# EAGLE design untitled (EAGLE 9.6.0)

## Sheet 1 of 2
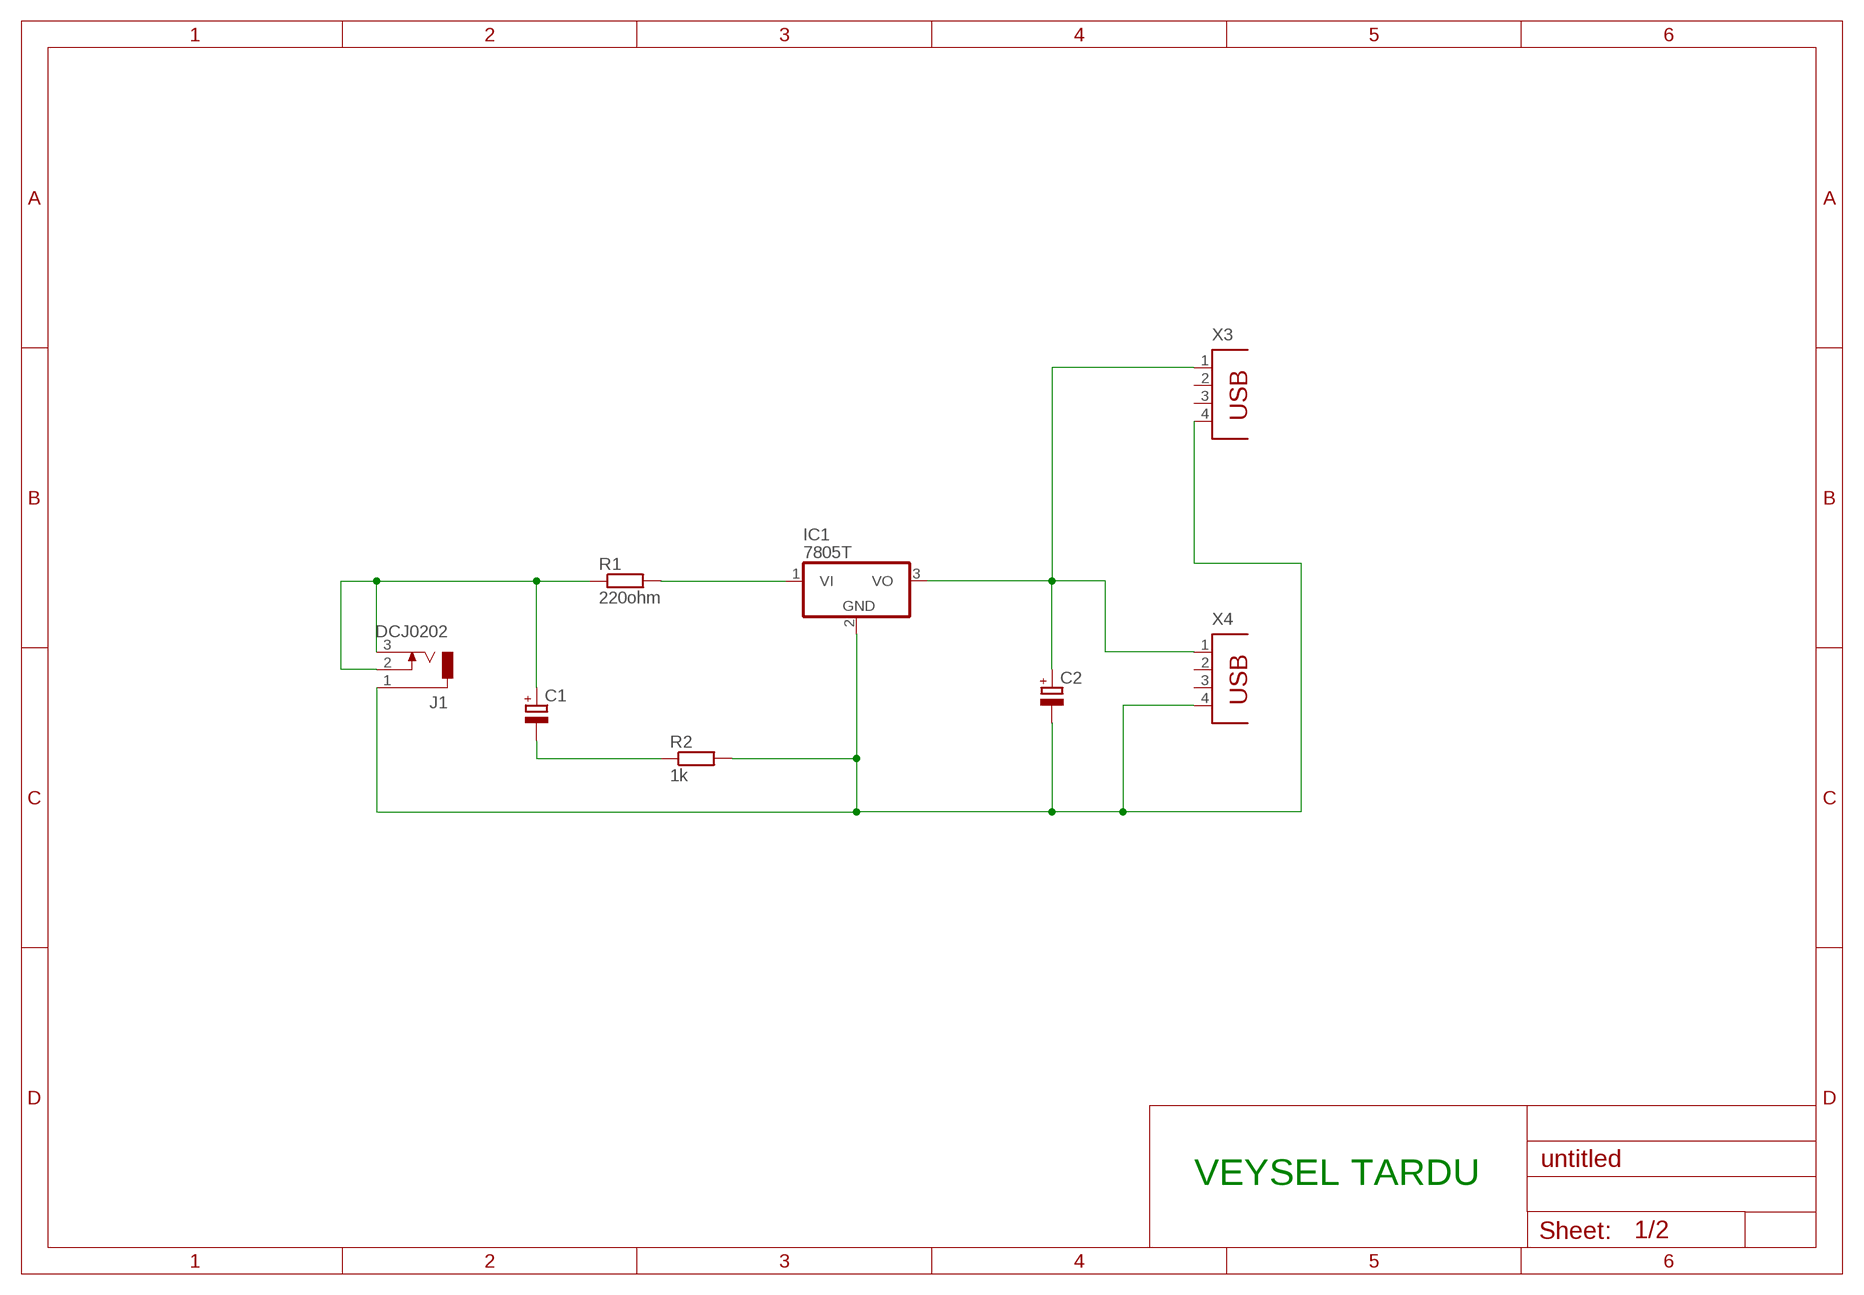
[diagram p0: schematic, sheet 1]

### Parts
C1  CPOL-EUE2-5  [E2-5]
C2  CPOL-EUE2-5  [E2-5]
IC1  7805T  [TO220H]
J1  DCJ0202  [DCJ0202]
R1  220ohm  R-EU_VMTA55  [VMTA55]
R2  1k  R-EU_VMTA55  [VMTA55]
X3  PN61729  [PN61729]
X4  PN61729  [PN61729]

### Nets
N$1: C1.+ J1.2 J1.3 R1.1
N$2: IC1.1(VI) R1.2
N$4: C2.- IC1.2(GND) J1.1 R2.2 X3.4 X4.4
N$5: C2.+ IC1.3(VO) X3.1 X4.1
N$6: C1.- R2.1
Unconnected: X3.2 X3.3 X4.2 X4.3

### Notes on the sheet
- VEYSEL TARDU

## Sheet 2 of 2

## Library data of the parts
C1 C2 = rcl:CPOL-EU: POLARIZED CAPACITOR, European symbol; SPICEPREFIX: C
IC1 = linear:78*: Positive VOLTAGE REGULATOR Source: http://cache.national.com/ds/LM/LM78L05.pdf http://www.fairchildsemi.com/ds/LM/LM7805.pdf
J1 = con-jack:DCJ0202: DC POWER JACK Source: DCJ0202.pdf; OC_FARNELL: unknown; OC_NEWARK: unknown
R1 R2 = rcl:R-EU_: RESISTOR, European symbol; SPICEPREFIX: R
X3 X4 = con-berg:PN61729: BERG USB connector; OC_FARNELL: unknown; OC_NEWARK: unknown

## Board
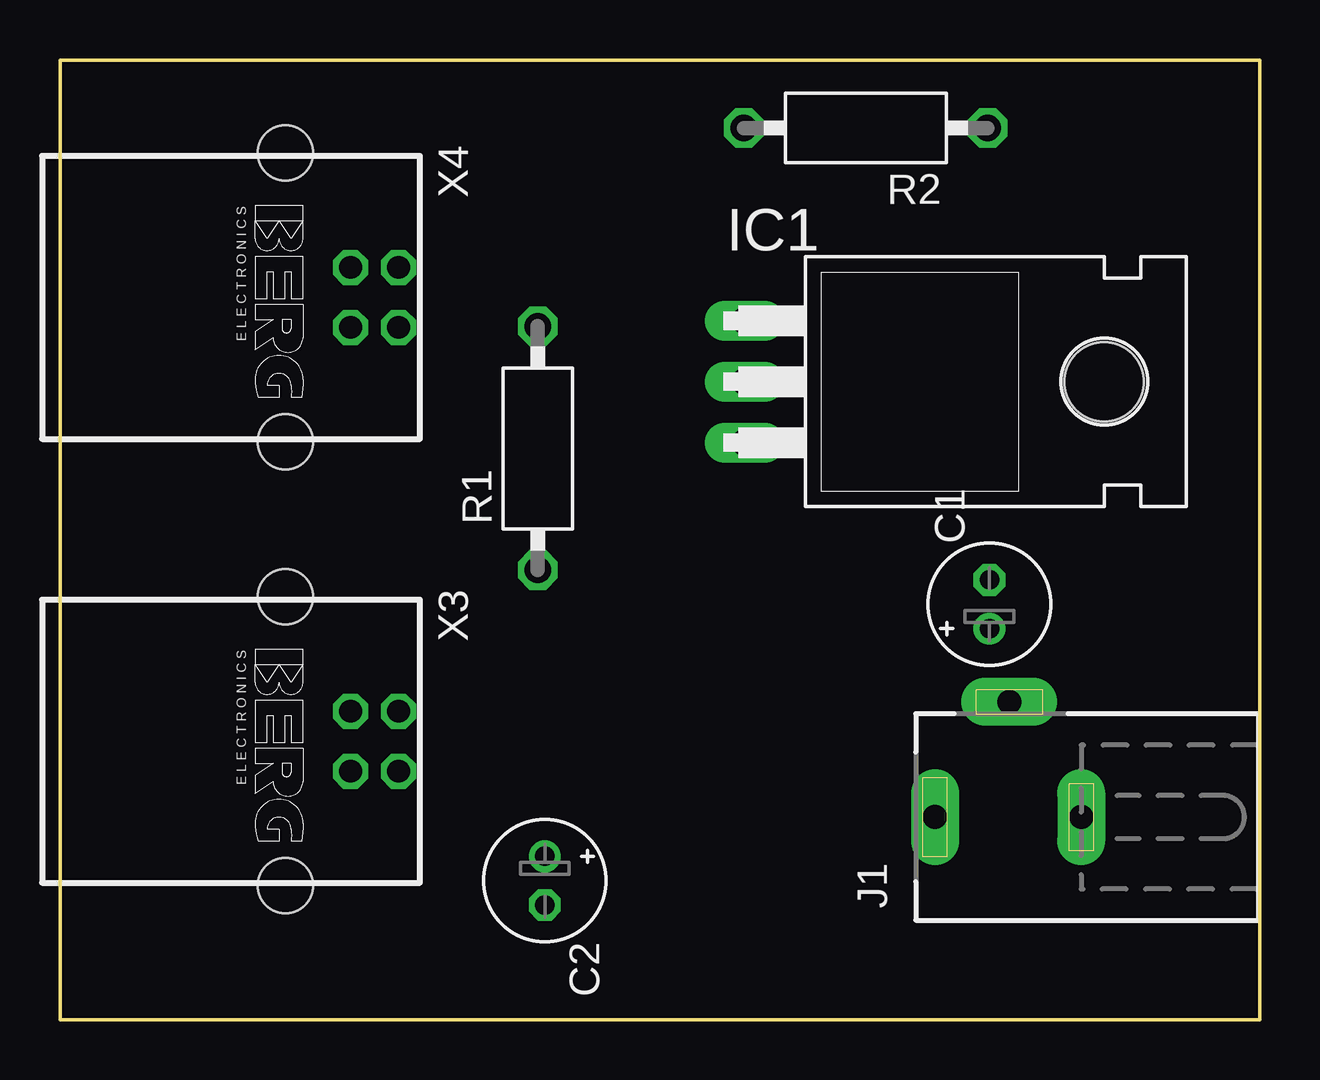
[diagram p1: board, top side]
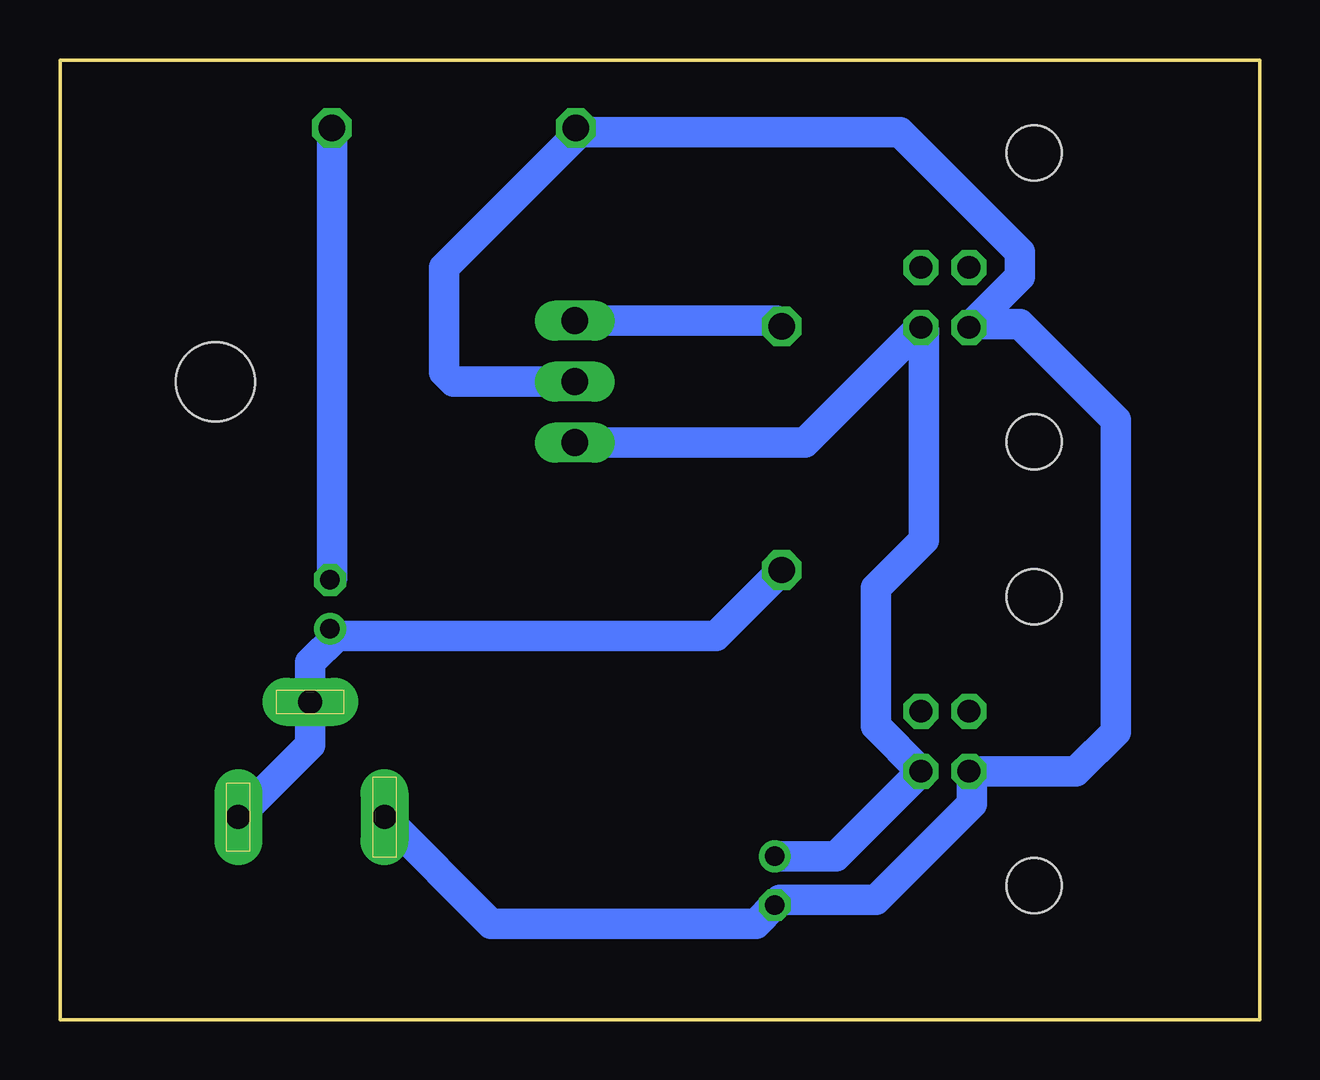
[diagram p2: board, bottom side, seen from below]

Size 50 x 40 mm. Coordinates in mm from the lower left corner, seen from the top.
Outline: 0,0 0,40 50,40 50,0 0,0
Copper layers (1*16): Top 0.035mm / dielectric 1.5mm / Bottom 0.035mm
Design rules "default": minimum track width 6mil, minimum drill 0.35mm, track to track 6mil, track to pad 6mil, pad to pad 6mil, via to via 6mil, smd to smd 6mil, copper to edge 40mil, drill to drill 6mil, minimum pad ring 10mil, minimum via ring 8mil, stop-mask expansion 4mil, vias tented up to drill 0mil, thermal gap 10mil

### Footprints (pad centres in the part's own frame; a part is rotated, then mirrored left to right if it is on the bottom)
E2-5 = drill 0.813 pad 1.27: + -1.016,0 | drill 0.813 pad 1.27 octagon: - 1.016,0
TO220H = drill 1.118 long: 1 -2.54,-10.16; 2 0,-10.16; 3 2.54,-10.16 | hole 3.302: 0,4.826
DCJ0202 = drill 1 pad 2 long: 1 0,3.1; 2 4.8,0; 3 0,-3
VMTA55 = drill 1.1 octagon: 1 -5.08,0; 2 5.08,0
PN61729 = drill 0.95 octagon: 1 1.25,4.71; 2 -1.25,4.71; 3 -1.25,2.71; 4 1.25,2.71 | hole 2.3: -6.02,0; 6.02,0

### Placement (x,y rotation side)
C1  38.74,17.31 90 top
C2  20.21,5.79 270 top
IC1  38.7,26.59 270 top
J1  39.57,8.44 90 top
R1  19.91,23.82 90 top
R2  33.58,37.16 180 top
X3  9.4,11.6 270 top
X4  9.4,30.1 270 top

### Tracks (layer width: path | path; a pad name or v marks a point on that pad's centre or on a via)
N$1
  Bottom 1.27: R1.1 22.65,16 38.45,16 | 38.45,16 C1.+ | J1.3 39.57,11.44 J1.2 39.57,14.88 38.45,16
N$2
  Bottom 1.27: R1.2 20.14,29.13 IC1.1
N$4
  Bottom 1.27: J1.1 32.03,4 20.98,4 C2.- 19.98,5 16,5 12,9 12,10.24 X3.4 7.65,10.35 6,12 6,25 10,29 11.96,29 X4.4 10,30.96 10,32 15,37 28.34,37 | 28.34,37 R2.2 | IC1.2 33.59,26.59 34,27 34,31.34 28.34,37
N$5
  Bottom 1.27: C2.+ 17.65,6.81 X3.1 16,12.24 16,18 14,20 14,28.74 X4.1 14.15,28.85 18.95,24.05 IC1.3
N$6
  Bottom 1.27: R2.1 38.66,18.41 C1.-